# Altium project Differential Probe.PrjPcb
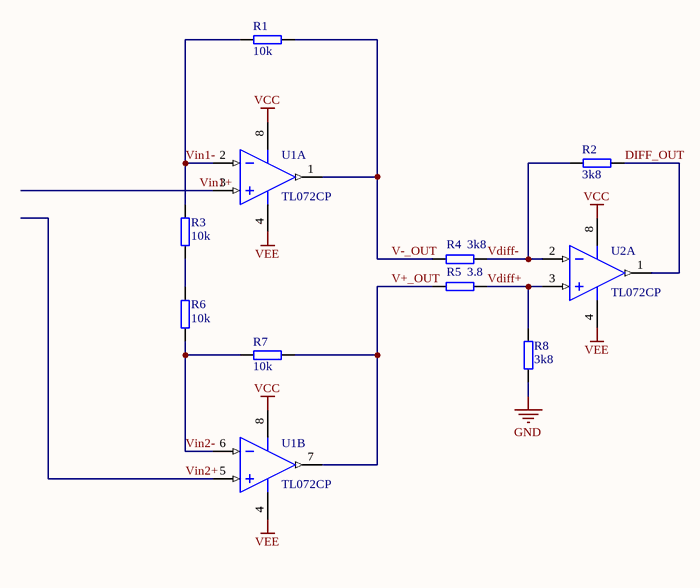
[diagram p0: Basic diff probe.SchDoc]
1 sheet, 10 parts. Net scope: global (net labels, ports and power ports of the same name join across sheets).
Board file: Basic diff probe.PcbDoc

## Sheet Basic diff probe.SchDoc
size A4; SheetNumber: 1; SheetTotal: 1

### Parts
R1  10k  [C_CERAMIC_TH_P5.08mm]
R2  3k8  [C_CERAMIC_TH_P5.08mm]
R3  10k  [C_CERAMIC_TH_P5.08mm]
R4  3k8  [C_CERAMIC_TH_P5.08mm]
R5  3.8  [C_CERAMIC_TH_P5.08mm]
R6  10k  [C_CERAMIC_TH_P5.08mm]
R7  10k  [C_CERAMIC_TH_P5.08mm]
R8  3k8  [C_CERAMIC_TH_P5.08mm]
U1  TL072CP  [P0008A]  (parts A,B of 2)
U2  TL072CP  [P0008A]  (part A of 2)

### Nets
GND: R8.1
VCC: U1.8(VCC+) U2.8(VCC+)
VEE: U1.4(VCC-) U2.4(VCC-)
DIFF_OUT: R2.2 U2.1(OUT1)
V+_OUT: R5.1 R7.2 U1.7(OUT2)
V-_OUT: R1.2 R4.1 U1.1(OUT1)
Vdiff+: R5.2 R8.2 U2.3(IN1+)
Vdiff-: R2.1 R4.2 U2.2(IN1-)
Vin1+: U1.3(IN1+)
Vin1-: R1.1 R3.2 U1.2(IN1-)
Vin2+: U1.5(IN1+)
Vin2-: R6.1 R7.1 U1.6(IN1-)
NetR3_1: R3.1 R6.2

### Library data of the parts
R1-R8 = Resistor: TH, Through Hole
U1 U2 = TL072CP: IC OPAMP JFET 3MHZ 8DIP; Manufacturer: Texas Instruments; Voltage Gain: 106.02dB; Nominal Supply Current: 5mA; Max Dual Supply Voltage: 18V; Min Dual Supply Voltage: 3.5V; Dual Supply Voltage: 9V; Common Mode Rejection Ratio: 70dB; Number of Channels: 2; Slew Rate: 13V/µs; Input Bias Current: 200pA; Input Offset Voltage (Vos): 3mV; Operating Supply Current: 1.4mA; Max I/O Voltage: 10mV; Supplier 1: Mouser; Manufacturer Part Number: TL072CP; RoHS: Yes; Category: Amplifiers - Op Amps, Buffer, Instrumentation; Stock 1: 18881; Pricing 1: 1=1,01000, 10=0,91100, 50=0,86300, 100=0,86300, 1000=0,86300, 10000=0,86300 (USD); Case/Package: P; Number of Pins: 8; Contact Plating: Gold; Min Operating Temperature: -40°C; Max Operating Temperature: 85°C; Package Quantity: 50; Packaging: Rail/Tube; Unity Gain Bandwidth Product: 3MHz; Number of Circuits: 2; Gain Bandwidth Product: 3MHz; Number of Amplifiers: 2; Number of Elements: 2; Bandwidth: 3MHz; Nominal Gain Bandwidth Product: 3MHz; Max Supply Voltage: 18V; Length: 9.81mm; Width: 6.35mm; Height: 4.57mm; Radiation Hardening: No; REACH SVHC: No SVHC; Lead Free: Lead Free; RoHS Compliant: Yes; ComponentLink1URL: https://datasheet.ciiva.com/7709/1764387-7709920.pdf?src-supplier=Element14; ComponentLink1Description: https://datasheet.ciiva.com/7709/1764387-7709920.pdf?src-supplier=Element14; ComponentLink2URL: https://datasheet.ciiva.com/1796/tl071a-1796082.pdf?src-supplier=Digi-Key; ComponentLink2Description: https://datasheet.ciiva.com/1796/tl071a-1796082.pdf?src-supplier=Digi-Key; ComponentLink3URL: https://datasheet.ciiva.com/2974/tl074-2974205.pdf?src-supplier=Avnet; ComponentLink3Description: https://datasheet.ciiva.com/2974/tl074-2974205.pdf?src-supplier=Avnet; Supplier Part Number 1: 595-TL072CP